# Altium schematic sheet rotary_table_v2.SchDoc
size C; Date: 09 July 2012; Author: Simon Markham; DrawnBy: Simon Markham; Engineer: Simon Markham; Organization: Markham Designs
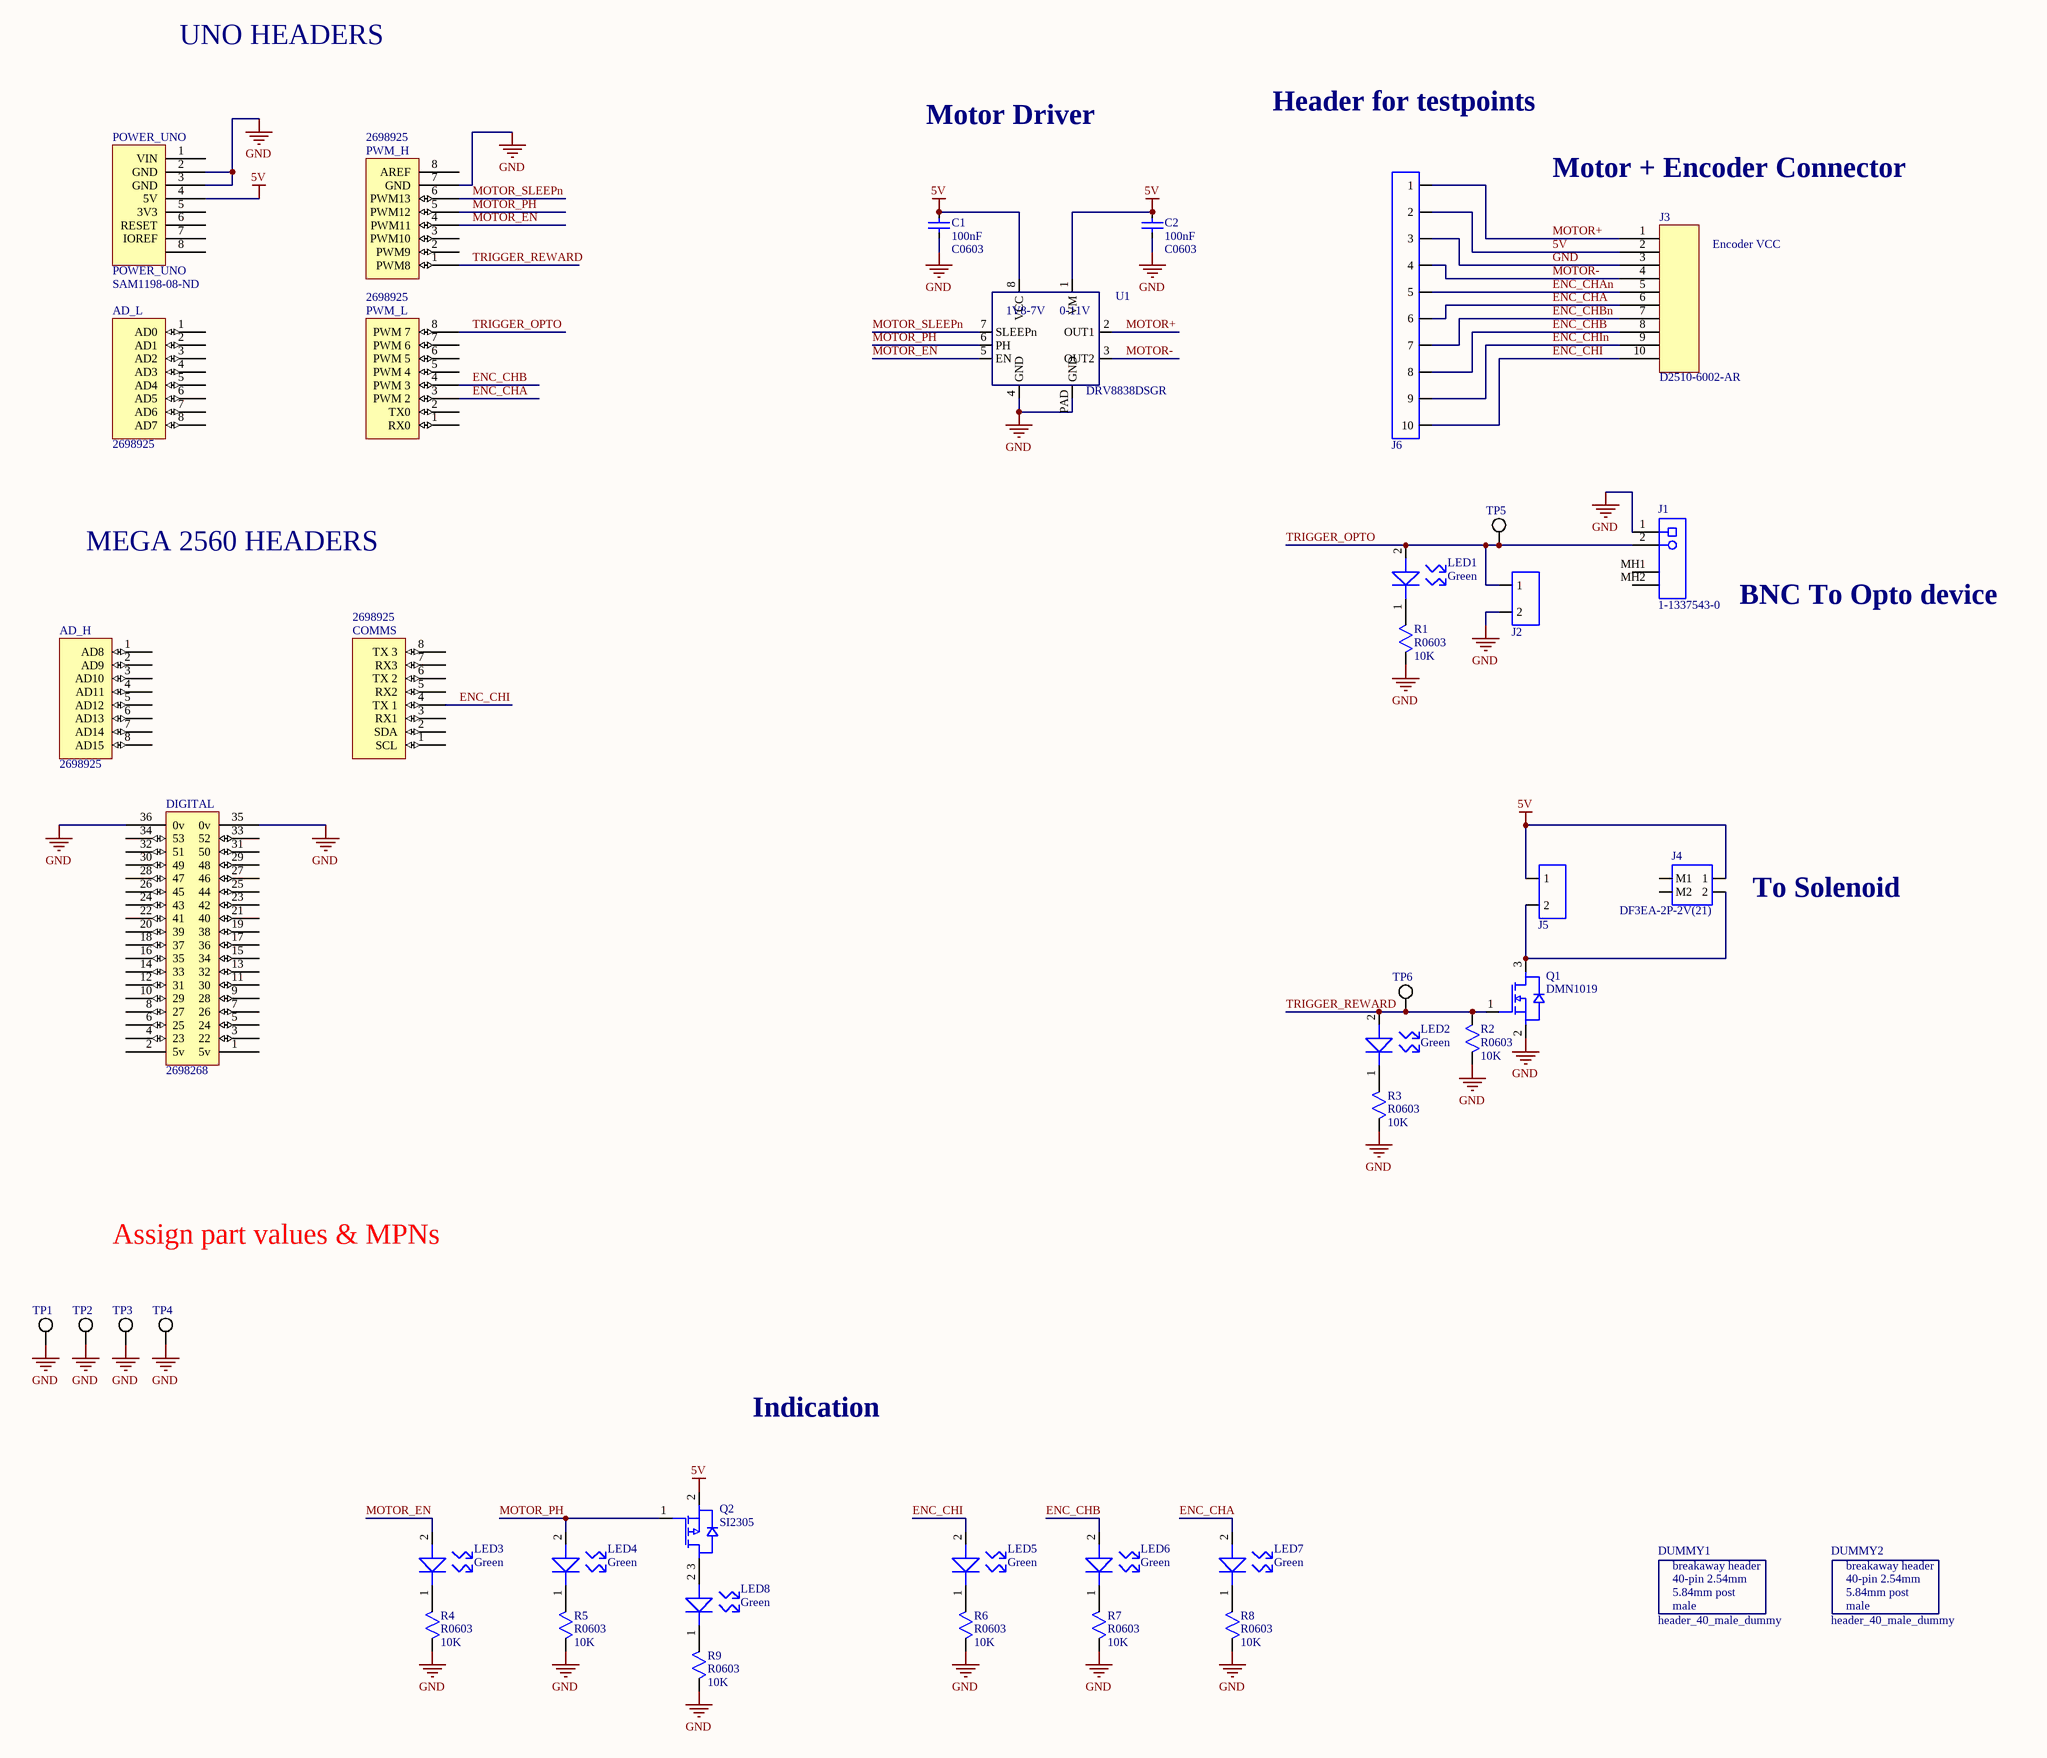
[diagram p0: rotary_table_v2.SchDoc]

## Parts
AD_H  Supplier Part Number 4: 2698925  [Header 8x1 8.5mm]  (hidden comment: AD_H)  (no BOM)
AD_L  Supplier Part Number 5: 2698925  [Header 8x1 8.5mm]  (hidden comment: AD_L)  (no BOM)
C1  100nF  [C0603]
C2  100nF  [C0603]
COMMS  Supplier Part Number 4: 2698925  [Header 8x1 8.5mm]  (hidden comment: Communication)  (no BOM)
DIGITAL  Supplier Part Number 5: 2698268  [HEADER 36X 8MM]  (hidden comment: IO_36)  (no BOM)
DUMMY1  header_40_male_dummy  (mechanical)
DUMMY2  header_40_male_dummy  (mechanical)
J1  1-1337543-0  [TECO-1-1337543-0_V]
J2  0.1in 2x1  [HEADER_2x1]  (value not drawn)  (no BOM)
J3  D2510-6002-AR  [D2510-6002]
J4  DF3EA-2P-2V(21)  [DF3EA-2P-2V(21)]
J5  0.1in 2x1  [HEADER_2x1]  (value not drawn)  (no BOM)
J6  0.1in 10x1  [HEADER_10x1]  (value not drawn)  (no BOM)
LED1  Green  [LED0603]
LED2  Green  [LED0603]
LED3  Green  [LED0603]
LED4  Green  [LED0603]
LED5  Green  [LED0603]
LED6  Green  [LED0603]
LED7  Green  [LED0603]
LED8  Green  [LED0603]
POWER_UNO  POWER_UNO  Supplier Part Number 2: SAM1198-08-ND  [Header 8x1 8.5mm]  (no BOM)
PWM_H  Supplier Part Number 4: 2698925  [Header 8x1 8.5mm]  (hidden comment: PWM_H)  (no BOM)
PWM_L  Supplier Part Number 4: 2698925  [Header 8x1 8.5mm]  (hidden comment: PWM_L)  (no BOM)
Q1  DMN1019  [SC59-3]
Q2  SI2305  [SOT23-3]
R1  value 10K  [R0603]  (hidden comment: Resistor)
R2  value 10K  [R0603]  (hidden comment: Resistor)
R3  value 10K  [R0603]  (hidden comment: Resistor)
R4  value 10K  [R0603]  (hidden comment: Resistor)
R5  value 10K  [R0603]  (hidden comment: Resistor)
R6  value 10K  [R0603]  (hidden comment: Resistor)
R7  value 10K  [R0603]  (hidden comment: Resistor)
R8  value 10K  [R0603]  (hidden comment: Resistor)
R9  value 10K  [R0603]  (hidden comment: Resistor)
TP1  GND  [TP_0IN1]  (value not drawn)  (no BOM)
TP2  GND  [TP_0IN1]  (value not drawn)  (no BOM)
TP3  GND  [TP_0IN1]  (value not drawn)  (no BOM)
TP4  GND  [TP_0IN1]  (value not drawn)  (no BOM)
TP5  OPTO  [TP_0IN1]  (value not drawn)  (no BOM)
TP6  REWARD  [TP_0IN1]  (value not drawn)  (no BOM)
U1  DRV8838DSGR  [WSON-8_PAD]

## Nets
5V: C1.2 C2.2 J3.2 J4.1 J5.1 J6.2 POWER_UNO.4(5V) Q2.2 U1.1(VM) U1.8(VCC)
GND: C1.1 C2.1 DIGITAL.35(0v) DIGITAL.36(0v) J1.1 J2.2 J3.3 J6.3 POWER_UNO.2(GND) POWER_UNO.3(GND) PWM_H.7(GND) Q1.2 R1.2 R2.2 R3.2 R4.2 R5.2 R6.2 R7.2 R8.2 R9.2 TP1.1(MTG) TP2.1(MTG) TP3.1(MTG) TP4.1(MTG) U1.4(GND) U1.PAD(GND)
ENC_CHA: J3.6 J6.6 LED7.2 PWM_L.3(PWM_2)
ENC_CHAn: J3.5 J6.5
ENC_CHB: J3.8 J6.8 LED6.2 PWM_L.4(PWM_3)
ENC_CHBn: J3.7 J6.7
ENC_CHI: COMMS.4(TX_1) J3.10 J6.10 LED5.2
ENC_CHIn: J3.9 J6.9
MOTOR+: J3.1 J6.1 U1.2(OUT1)
MOTOR-: J3.4 J6.4 U1.3(OUT2)
MOTOR_EN: LED3.2 PWM_H.4(PWM11) U1.5(EN)
MOTOR_PH: LED4.2 PWM_H.5(PWM12) Q2.1 U1.6(PH)
MOTOR_SLEEPn: PWM_H.6(PWM13) U1.7(SLEEPn)
TRIGGER_OPTO: J1.2 J2.1 LED1.2 PWM_L.8(PWM_7) TP5.1(MTG)
TRIGGER_REWARD: LED2.2 PWM_H.1(PWM8) Q1.1 R2.1 TP6.1(MTG)
NetJ4_2: J4.2 J5.2 Q1.3
NetLED1_1: LED1.1 R1.1
NetLED2_1: LED2.1 R3.1
NetLED3_1: LED3.1 R4.1
NetLED4_1: LED4.1 R5.1
NetLED5_1: LED5.1 R6.1
NetLED6_1: LED6.1 R7.1
NetLED7_1: LED7.1 R8.1
NetLED8_1: LED8.1 R9.1
NetLED8_2: LED8.2 Q2.3

Not connected (* = marked no-connect by the designer): AD_H 1(AD8) 2(AD9) 3(AD10) 4(AD11) 5(AD12) 6(AD13) 7(AD14) 8(AD15); AD_L 1(AD0) 2(AD1) 3(AD2) 4(AD3) 5(AD4) 6(AD5) 7(AD6) 8(AD7); COMMS 1(SCL) 2(SDA) 3(RX1) 5(RX2) 6(TX_2) 7(RX3) 8(TX_3); DIGITAL 1(5v) 2(5v) 3(22) 4(23) 5(24) 6(25) 7(26) 8(27) 9(28) 10(29) 11(30) 12(31) 13(32) 14(33) 15(34) 16(35) 17(36) 18(37) 19(38) 20(39) 21(40) 22(41) 23(42) 24(43) 25(44) 26(45) 27(46) 28(47) 29(48) 30(49) 31(50) 32(51) 33(52) 34(53); J1 MH1 MH2; J4 M1 M2; POWER_UNO 1(VIN) 5(3V3) 6(RESET) 7(IOREF) 8; PWM_H 2(PWM9) 3(PWM10) 8(AREF); PWM_L 1(RX0) 2(TX0) 5(PWM_4) 6(PWM_5) 7(PWM_6)

## Notes on the sheet
- UNO HEADERS
- Motor Driver
- Header for testpoints
- Motor + Encoder Connector
- Encoder VCC
- MEGA 2560 HEADERS
- BNC To Opto device
- (near J4) To Solenoid
- Assign part values & MPNs
- Indication
- (in symbol DRV8838DSGR) 1V8-7V; 0-11V
- (in symbol header_40_male_dummy) breakaway header; 40-pin 2.54mm; 5.84mm post; male

## Library data of the parts
C1 C2 = CAP: Nonpolarized capacitor; Manufacturer: Samsung; MfgPartNumber: CL10B104KC8VPNC; VoltageRating: 25V; DigikeyPartNumber: 1276-CL10B104KC8VPNCCT-ND; Value: 100nF; Package: C0603
DUMMY1 DUMMY2 = header_40_male_dummy: row of 40 pins breakaway male 2.54mm; Manufacturer: Sullins; MfgPartNumber: PRPC040SAAN-RC; DigikeyPartNumber: S1011EC-40-ND
J1 = CMP-2000-05853-1: Female Connector, Pitch 2.54 mm, 1 x 2 Position, Height 15.8 mm, Tail Length 3.8 mm, / -55 to 85 degC, RoHS, Bulk; Manufacturer: TE Connectivity; Connector Body Style: RightAngleJack; Frequency Max: 4GHz; Coaxial Termination: Solder; Connector Mounting: PCBMount; SVHC: ToBeAdvised; Connector Type: BNCCoaxial; Impedance: 50ohm; Coaxial Cable Types: -; Manufacturer URL: http://www.te.com/; Package Reference: 1-1337543-0; Product Range: -; Datasheet URL: http://www.te.com/commerce/DocumentDelivery/DDEController?Action=showdoc&DocId=Customer+Drawing%7F1337543%7FG%7Fpdf%7FEnglish%7FENG_CD_1337543_G.pdf%7F1-1337543-0; Contact Plating: GoldPlatedContacts; Mounting Technology: ThroughHole; Package Description: Female Connector, Pitch 2.54 mm, 1 x 2 Position, Height 15.8 mm, Tail Length 3.8 mm; Contact Material: Brass; Datasheet Version: Rev. G, 12/2012; DigikeyPartNumber: A97553-ND
J2 J5 = HEADER_2x1: 0.1in header 2x1; Gender: Male; Package: HEADER_2x1
J3 = D2510-6002-AR: CONN HEADER 10POS VERT 10GOLD; Manufacturer: 3M; Connector Type: Header, Shrouded; Number of Positions: 10; Number of Positions Loaded: All; Pitch: 0.100" (2.54mm); Category: Connectors, Interconnects; Supplier 1: Digi-Key; RoHS: RoHS Compliant; Stock 1: 1435; Pricing 1: 1=1.57, 10=1.421, 50=1.276, 100=1.218, 250=1.102, 500=1.015, 1000=0.87, 2500=0.812, 5000=0.7714 (USD); Packaging: Bulk; Contact Type: Male Pin; Number of Rows: 2; Row Spacing: 0.100" (2.54mm); Contact Mating Length: 0.243" (6.17mm); Mounting Type: Through Hole; Termination: Solder; Fastening Type: -; Features: -; Contact Finish: Gold; Contact Finish Thickness: 10µin (0.25µm); Color: Black; ComponentLink1URL: http://multimedia.3m.com/mws/mediawebserver?66666UuZjcFSLXTtm8T_oxMcEVuQEcuZgVs6EVs6E666666--; ComponentLink1Description: http://multimedia.3m.com/mws/mediawebserver?66666UuZjcFSLXTtm8T_oxMcEVuQEcuZgVs6EVs6E666666--; Supplier Part Number 1: MHC10E-ND; Supplier 2: Digi-Key; Supplier Part Number 2: PCD1760CT-ND; Manufacturer Part Number: D2510-6002-AR; Value: *; DigikeyPartNumber: MHC10E-ND
J4 = DF3EA-2P-2V(21): CONN HEADER SMD 2POS 2MM; Manufacturer: Hirose; DigikeyPartNumber: H125461CT-ND; MfgPartNumber: DF3EA-2P-2V(21)
J6 = HEADER_10x1: 0.1in header 10x1; Gender: Male; Package: HEADER_10x1
LED1-LED8 = LED: Manufacturer: Wurth Elektronik; MfgPartNumber: 150060VS75000; Package: LED0603; DigikeyPartNumber: 732-4980-1-ND; Color: Green
Q1 = DMN1019UVT: MOSFET N-CH 12V 9.3A SC59; Manufacturer: Diodes Incorporated; MfgPartNumber: DMN1019USN-7; Ron: 13m-ohm at 1.8V; DigikeyPartNumber: DMN1019USN-7DICT-ND; Vds max: 12V
Q2 = SI2305: P-CHANNEL MOSFET, SOT-23 PACKAGE; Manufacturer: Micro Commercial Co; MfgPartNumber: SI2305-TP; VDS: -8V; Rds: 90mohm @ Vgs = -1.8V; DigikeyPartNumber: SI2305-TPMSCT-ND
R1-R9 = RES: Manufacturer: Stackpole; MfgPartNumber: RMCF0603FT10K0; Tolerance: 1%; DigikeyPartNumber: RMCF0603FT10K0CT-ND
TP1-TP6 = TP_0IN1: hole for 0.1in header. No BOM item.
U1 = DRV8838DSGR: IC BRIDGE DRIVER PAR 8WSON; Manufacturer: Texas Instruments; MfgPartNumber: DRV8838DSGR; DigikeyPartNumber: 296-40081-1-ND
AD_H = AD_H: Supplier 1: Arrow; Supplier Part Number 1: 2698940; Supplier 2: Arrow; Supplier Part Number 2: 2698939; Supplier 3: Digi-Key; Supplier Part Number 3: SAM1198-08-ND; Supplier 4: Arrow
AD_L = AD_L: Supplier 1: Digi-Key; Supplier Part Number 1: SAM1198-08-ND; Supplier 2: Arrow; Supplier Part Number 2: 2698939; Supplier 3: Arrow; Supplier Part Number 3: 2698940; Supplier 4: Arrow; Supplier Part Number 4: 43085273; Supplier 5: Arrow
COMMS = Communication: Supplier 1: Digi-Key; Supplier Part Number 1: SAM1198-08-ND; Supplier 2: Arrow; Supplier Part Number 2: 2698940; Supplier 3: Arrow; Supplier Part Number 3: 2698939; Supplier 4: Arrow
DIGITAL = IO_36: Supplier 1: Digi-Key; Supplier Part Number 1: SAM1196-18-ND; Supplier 2: Arrow; Supplier Part Number 2: 48117090; Supplier 3: Arrow; Supplier Part Number 3: 46093326; Supplier 4: Arrow; Supplier Part Number 4: 2698278; Supplier 5: Arrow
POWER_UNO = POWER_UNO: Supplier 1: Arrow; Supplier 2: Digi-Key; Supplier 3: Arrow; Supplier Part Number 1: 2698925; Supplier Part Number 3: 2698940
PWM_H = PWM_H: Supplier 1: Digi-Key; Supplier Part Number 1: SAM1198-08-ND; Supplier 2: Arrow; Supplier Part Number 2: 2698940; Supplier 3: Arrow; Supplier Part Number 3: 2698939; Supplier 4: Arrow
PWM_L = PWM_L: Supplier 1: Arrow; Supplier Part Number 1: 2698940; Supplier 2: Arrow; Supplier Part Number 2: 2698939; Supplier 3: Digi-Key; Supplier Part Number 3: SAM1198-08-ND; Supplier 4: Arrow